# Altium schematic sheet flash.schdoc: FLASH
size A4; Date: 10.25.2025; CheckedBy: BCY; DrawnBy: miaow; DocumentNumber: 5; Revision: v1.0.0; SheetNumber: 5; SheetTotal: 14; BoardType: MAIN_PCB; Desc: NOR flash for mcu
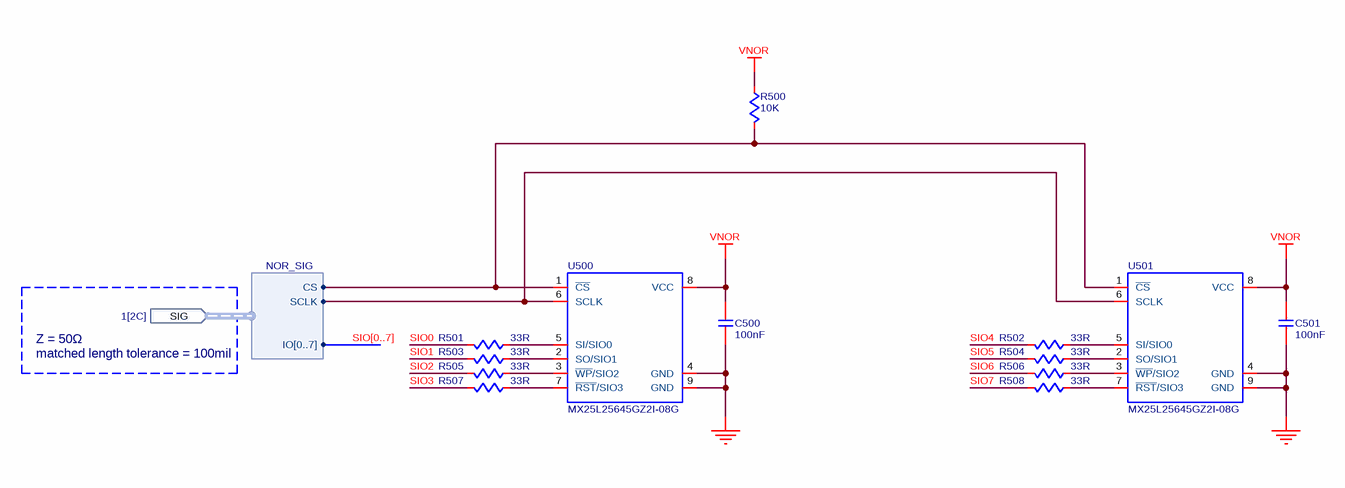
[diagram p0: flash.schdoc]

## Parts
C500  value 100nF  [C0402]  (hidden comment: C-NOMO)
C501  value 100nF  [C0402]  (hidden comment: C-NOMO)
R500  value 10K  [R0402]  (hidden comment: R)
R501  value 33R  [R0402]  (hidden comment: R)
R502  value 33R  [R0402]  (hidden comment: R)
R503  value 33R  [R0402]  (hidden comment: R)
R504  value 33R  [R0402]  (hidden comment: R)
R505  value 33R  [R0402]  (hidden comment: R)
R506  value 33R  [R0402]  (hidden comment: R)
R507  value 33R  [R0402]  (hidden comment: R)
R508  value 33R  [R0402]  (hidden comment: R)
U500  MX25L25645GZ2I-08G  [MX25L25645GZ2I-08G]
U501  MX25L25645GZ2I-08G  [MX25L25645GZ2I-08G]

## Ports
SIG (in, harness NOR_SIG, see 1[2C])

## Harnesses
NOR_SIG: CS, SCLK, IO[0..7]

## Nets
GND: C500.1 C501.1 U500.4(GND) U500.9(GND) U501.4(GND) U501.9(GND)
VNOR: C500.2 C501.2 R500.2 U500.8(VCC) U501.8(VCC)
SIO0: R501.1
SIO1: R503.1
SIO2: R505.1
SIO3: R507.1
SIO4: R502.1
SIO5: R504.1
SIO6: R506.1
SIO7: R508.1
NetR500_1: R500.1 U500.1(~{CS}) U501.1(~{CS}) ; port SIG.CS
NetR501_2: R501.2 U500.5(SI/SIO0)
NetR502_2: R502.2 U501.5(SI/SIO0)
NetR503_2: R503.2 U500.2(SO/SIO1)
NetR504_2: R504.2 U501.2(SO/SIO1)
NetR505_2: R505.2 U500.3(~{WP}/SIO2)
NetR506_2: R506.2 U501.3(~{WP}/SIO2)
NetR507_2: R507.2 U500.7(~{RST}/SIO3)
NetR508_2: R508.2 U501.7(~{RST}/SIO3)
NetU500_6: U500.6(SCLK) U501.6(SCLK) ; port SIG.SCLK

## Buses and harness runs
bus SIO[0..7]

## Notes on the sheet
- Z = 50Ω
  matched length tolerance = 100mil
- DRAWN
- CHECKED
- DRAWNBY
- SHEETS
- SHEETS_NO

## Library data of the parts
C500 C501 = C-NOMO: voltage: 25V; precision: 5%
R500-R508 = R: precision: 1%
U500 U501 = MX25L25645GZ2I-08G: Supplier 1: LCSC; Supplier Part Number 1: C2802978